# EAGLE design A10-A20-OLINUXINO-MICRO_Extension_Rev_A_STMP15x-SHIELD_GPIO1_EXTENSION (EAGLE 7.7.0)
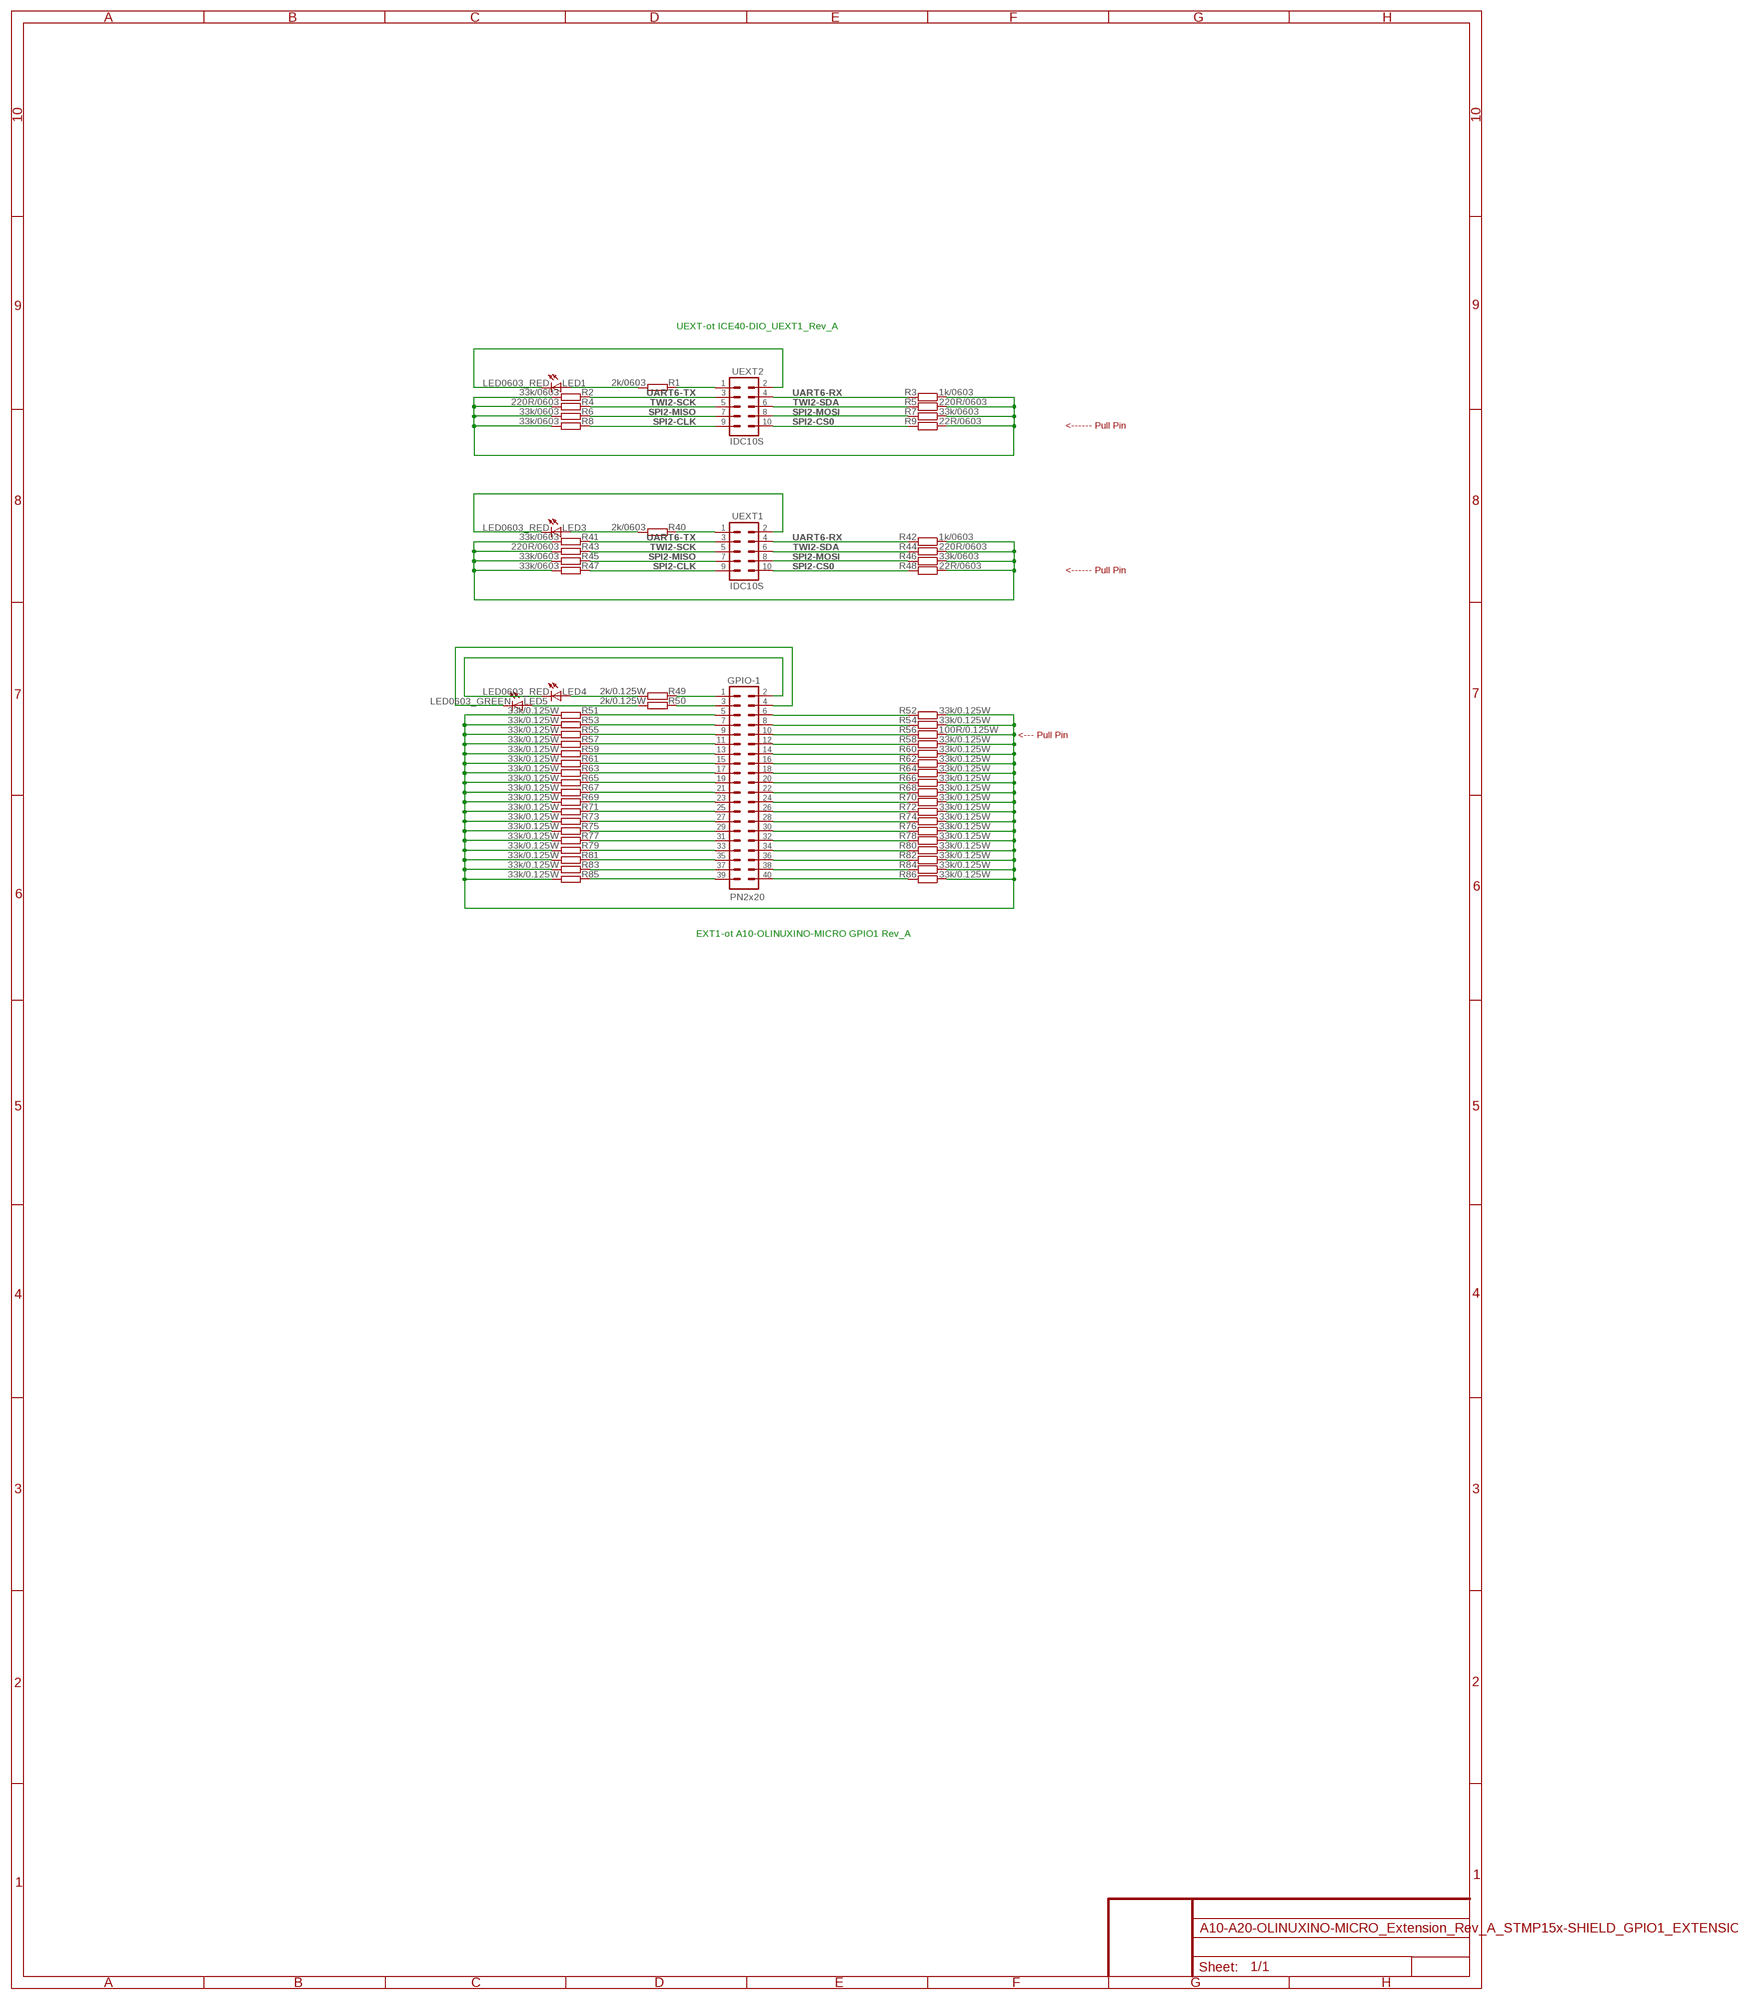
[diagram p0: schematic, sheet 1]

## Parts
GPIO-1  PN2x20  ML40PN2X20  [ML40-FEMALE(PN2X20)]
LED1  LED0603_RED  LED0603DWS  [LED-0603]
LED3  LED0603_RED  LED0603DWS  [LED-0603]
LED4  LED0603_RED  LED0603DWS  [LED-0603]
LED5  LED0603_GREEN  LED0603DWS  [LED-0603]
R1  2k/0603  R-EU_0204/5  [0204/5]
R2  33k/0603  R-EU_0204/5  [0204/5]
R3  1k/0603  R-EU_0204/5  [0204/5]
R4  220R/0603  R-EU_0204/5  [0204/5]
R5  220R/0603  R-EU_0204/5  [0204/5]
R6  33k/0603  R-EU_0204/5  [0204/5]
R7  33k/0603  R-EU_0204/5  [0204/5]
R8  33k/0603  R-EU_0204/5  [0204/5]
R9  22R/0603  R-EU_0204/5  [0204/5]
R40  2k/0603  R-EU_0204/5  [0204/5]
R41  33k/0603  R-EU_0204/5  [0204/5]
R42  1k/0603  R-EU_0204/5  [0204/5]
R43  220R/0603  R-EU_0204/5  [0204/5]
R44  220R/0603  R-EU_0204/5  [0204/5]
R45  33k/0603  R-EU_0204/5  [0204/5]
R46  33k/0603  R-EU_0204/5  [0204/5]
R47  33k/0603  R-EU_0204/5  [0204/5]
R48  22R/0603  R-EU_0204/5  [0204/5]
R49  2k/0.125W  R-EU_0204/5  [0204/5]
R50  2k/0.125W  R-EU_0204/5  [0204/5]
R51  33k/0.125W  R-EU_0204/5  [0204/5]
R52  33k/0.125W  R-EU_0204/5  [0204/5]
R53  33k/0.125W  R-EU_0204/5  [0204/5]
R54  33k/0.125W  R-EU_0204/5  [0204/5]
R55  33k/0.125W  R-EU_0204/5  [0204/5]
R56  100R/0.125W  R-EU_0204/5  [0204/5]
R57  33k/0.125W  R-EU_0204/5  [0204/5]
R58  33k/0.125W  R-EU_0204/5  [0204/5]
R59  33k/0.125W  R-EU_0204/5  [0204/5]
R60  33k/0.125W  R-EU_0204/5  [0204/5]
R61  33k/0.125W  R-EU_0204/5  [0204/5]
R62  33k/0.125W  R-EU_0204/5  [0204/5]
R63  33k/0.125W  R-EU_0204/5  [0204/5]
R64  33k/0.125W  R-EU_0204/5  [0204/5]
R65  33k/0.125W  R-EU_0204/5  [0204/5]
R66  33k/0.125W  R-EU_0204/5  [0204/5]
R67  33k/0.125W  R-EU_0204/5  [0204/5]
R68  33k/0.125W  R-EU_0204/5  [0204/5]
R69  33k/0.125W  R-EU_0204/5  [0204/5]
R70  33k/0.125W  R-EU_0204/5  [0204/5]
R71  33k/0.125W  R-EU_0204/5  [0204/5]
R72  33k/0.125W  R-EU_0204/5  [0204/5]
R73  33k/0.125W  R-EU_0204/5  [0204/5]
R74  33k/0.125W  R-EU_0204/5  [0204/5]
R75  33k/0.125W  R-EU_0204/5  [0204/5]
R76  33k/0.125W  R-EU_0204/5  [0204/5]
R77  33k/0.125W  R-EU_0204/5  [0204/5]
R78  33k/0.125W  R-EU_0204/5  [0204/5]
R79  33k/0.125W  R-EU_0204/5  [0204/5]
R80  33k/0.125W  R-EU_0204/5  [0204/5]
R81  33k/0.125W  R-EU_0204/5  [0204/5]
R82  33k/0.125W  R-EU_0204/5  [0204/5]
R83  33k/0.125W  R-EU_0204/5  [0204/5]
R84  33k/0.125W  R-EU_0204/5  [0204/5]
R85  33k/0.125W  R-EU_0204/5  [0204/5]
R86  33k/0.125W  R-EU_0204/5  [0204/5]
UEXT1  IDC10S  ML10ML10-FEMALE(IDC10S/PCB)  [ML10-FEMALE(IDC10S/PCB)]
UEXT2  IDC10S  ML10ML10-FEMALE(IDC10S/PCB)  [ML10-FEMALE(IDC10S/PCB)]

## Nets
GPIO1: GPIO-1.35 R81.2
GPIO2: GPIO-1.37 R83.2
GPIO3: GPIO-1.39 R85.2
N$1: LED1.A R1.1
N$2: R2.1 R3.1 R4.1 R5.1 R6.1 R7.1 R8.1 R9.1
N$3: R51.1 R52.1 R53.1 R54.1 R55.1 R56.1 R57.1 R58.1 R59.1 R60.1 R61.1 R62.1 R63.1 R64.1 R65.1 R66.1 R67.1 R68.1 R69.1 R70.1 R71.1 R72.1 R73.1 R74.1 R75.1 R76.1 R77.1 R78.1 R79.1 R80.1 R81.1 R82.1 R83.1 R84.1 R85.1 R86.1
N$4: R41.1 R42.1 R43.1 R44.1 R45.1 R46.1 R47.1 R48.1
N$5: LED3.A R40.1
N$6 [pwr]: R1.2 UEXT2.1
N$7 [pwr]: LED1.C UEXT2.2
N$8: LED5.A R50.1
N$9: LED4.A R49.1
N$15 [pwr]: LED3.C UEXT1.2
N$22 [pwr]: R40.2 UEXT1.1
N$24 [pwr]: GPIO-1.3 R50.2
N$25 [pwr]: GPIO-1.2 LED4.C
N$26 [pwr]: GPIO-1.4 LED5.C
N$27: GPIO-1.1 R49.2
NMI_N: GPIO-1.38 R84.2
PC3/NCE1: GPIO-1.21 R67.2
PC7/NRB1: GPIO-1.23 R69.2
PC16: GPIO-1.25 R71.2
PC17: GPIO-1.27 R73.2
PC18: GPIO-1.29 R75.2
PC23: GPIO-1.31 R77.2
PC24/NQS: GPIO-1.33 R79.2
PE0: GPIO-1.6 R52.2
PE1 [pwr]: GPIO-1.8 R54.2
PE2: GPIO-1.10 R56.2
PE3 [pwr]: GPIO-1.12 R58.2
PE4: GPIO-1.14 R60.2
PE5: GPIO-1.16 R62.2
PE6: GPIO-1.18 R64.2
PE7: GPIO-1.20 R66.2
PE8: GPIO-1.22 R68.2
PE9: GPIO-1.24 R70.2
PE10: GPIO-1.26 R72.2
PE11: GPIO-1.28 R74.2
PI0: GPIO-1.9 R55.2
PI1: GPIO-1.11 R57.2
PI2: GPIO-1.13 R59.2
PI3: GPIO-1.15 R61.2
PI10: GPIO-1.17 R63.2
PI11: GPIO-1.19 R65.2
PI14: GPIO-1.30 R76.2
PI15: GPIO-1.32 R78.2
RESET_N: GPIO-1.40 R86.2
SPI2-CLK: R8.2 R47.2 UEXT1.9 UEXT2.9
SPI2-CS0: R9.2 R48.2 UEXT1.10 UEXT2.10
SPI2-MISO: R6.2 R45.2 UEXT1.7 UEXT2.7
SPI2-MOSI: R7.2 R46.2 UEXT1.8 UEXT2.8
TWI0-SCK: GPIO-1.5 R51.2
TWI0-SDA: GPIO-1.7 R53.2
TWI2-SCK: R4.2 R43.2 UEXT1.5 UEXT2.5
TWI2-SDA: R5.2 R44.2 UEXT1.6 UEXT2.6
UART0-RX: GPIO-1.34 R80.2
UART0-TX: GPIO-1.36 R82.2
UART6-RX: R3.2 R42.2 UEXT1.4 UEXT2.4
UART6-TX: R2.2 R41.2 UEXT1.3 UEXT2.3

## Notes on the sheet
- UEXT-ot ICE40-DIO_UEXT1_Rev_A
- <------ Pull Pin
- <------ Pull Pin
- <--- Pull Pin
- EXT1-ot A10-OLINUXINO-MICRO GPIO1 Rev_A

## Library data of the parts
GPIO-1 = con-harting-ml:ML40: HARTING
LED1 LED3-LED5 = DOUBLE-SIDE:LED
R1-R9 R40-R86 = rcl:R-EU_: RESISTOR, European symbol
UEXT1 UEXT2 = con-harting-ml:ML10: HARTING

## Board
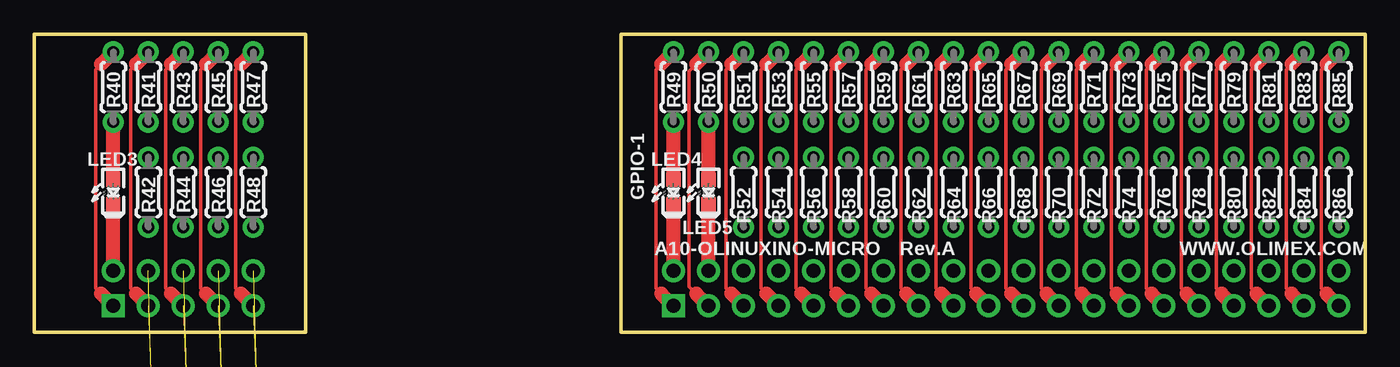
[diagram p1: board, top side]
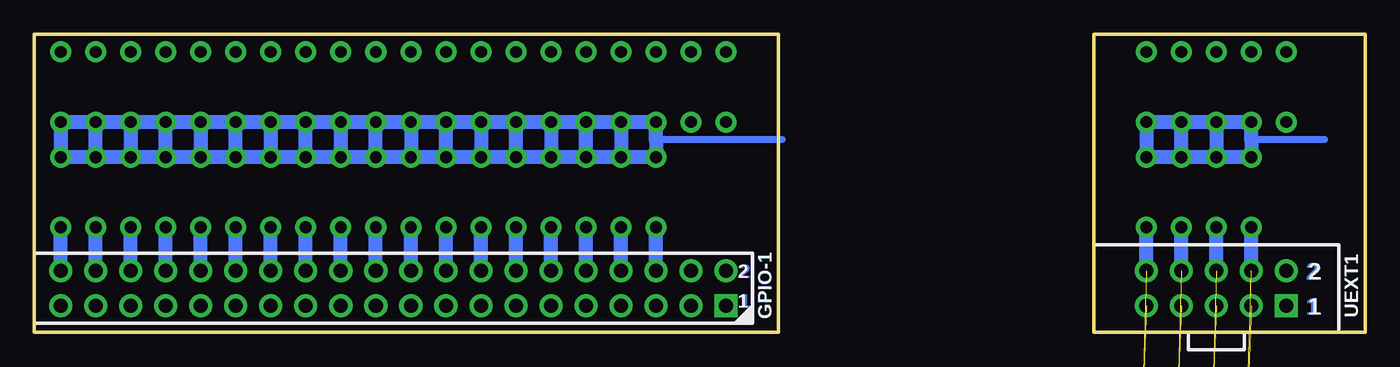
[diagram p2: board, bottom side, seen from below]

Size 96.52 x 21.59 mm. Coordinates in mm from the lower left corner, seen from the top.
Outline: 42.55,0 96.52,0 96.52,21.59 42.55,21.59 42.55,0
Outline: 19.68,0 0,0 0,21.59 19.68,21.59 19.68,0
Copper layers (1*2*15*16): Top 0.018mm / dielectric 0.12mm / Route2 0.035mm / dielectric 1.2mm / Route15 0.035mm / dielectric 0.12mm / Bottom 0.018mm
Design rules "default": minimum track width 4.5mil, minimum drill 10mil, track to track 5mil, track to pad 5mil, pad to pad 5mil, via to via 5mil, smd to smd 1mil, copper to edge 10mil, drill to drill 8mil, minimum pad ring 6mil, minimum via ring 4mil, stop-mask expansion 4mil, vias tented up to drill 25mil, thermal gap 12mil

### Footprints (pad centres in the part's own frame; a part is rotated, then mirrored left to right if it is on the bottom)
ML40-FEMALE(PN2X20) = drill 1.016 pad 1.676 square: 1 -24.13,1.27 | drill 1.016 pad 1.676: 2 -24.13,-1.27; 3 -21.59,1.27; 4 -21.59,-1.27; 5 -19.05,1.27; 6 -19.05,-1.27; 7 -16.51,1.27; 8 -16.51,-1.27; 9 -13.97,1.27; 10 -13.97,-1.27; 11 -11.43,1.27; 12 -11.43,-1.27; 13 -8.89,1.27; 14 -8.89,-1.27; 15 -6.35,1.27; 16 -6.35,-1.27; 17 -3.81,1.27; 18 -3.81,-1.27; 19 -1.27,1.27; 20 -1.27,-1.27; 21 1.27,1.27; 22 1.27,-1.27; 23 3.81,1.27; 24 3.81,-1.27; 25 6.35,1.27; 26 6.35,-1.27; 27 8.89,1.27; 28 8.89,-1.27; 29 11.43,1.27; 30 11.43,-1.27; 31 13.97,1.27; 32 13.97,-1.27; 33 16.51,1.27; 34 16.51,-1.27; 35 19.05,1.27; 36 19.05,-1.27; 37 21.59,1.27; 38 21.59,-1.27; 39 24.13,1.27; 40 24.13,-1.27
LED-0603 = smd 1.016 x 1.016: A 0.889,0; C -0.889,0
0204/5 = drill 0.864 pad 1.524: 1 -2.54,0; 2 2.54,0
ML10-FEMALE(IDC10S/PCB) = drill 1.016 pad 1.676 square: 1 -5.08,1.27 | drill 1.016 pad 1.676: 2 -5.08,-1.27; 3 -2.54,1.27; 4 -2.54,-1.27; 5 0,1.27; 6 0,-1.27; 7 2.54,1.27; 8 2.54,-1.27; 9 5.08,1.27; 10 5.08,-1.27

### Placement (x,y rotation side)
GPIO-1  70.48,3.17 180 bottom
LED1  41.91,-76.2 0 top  (outside the outline)
LED3  5.71,10.16 90 top
LED4  46.35,10.16 90 top
LED5  48.9,10.16 90 top
R1  35.56,-15.24 0 top  (outside the outline)
R2  7.62,-34.29 0 top  (outside the outline)
R3  27.94,-34.29 0 top  (outside the outline)
R4  7.62,-49.53 0 top  (outside the outline)
R5  27.94,-49.53 0 top  (outside the outline)
R6  7.62,-64.77 0 top  (outside the outline)
R7  27.94,-64.77 0 top  (outside the outline)
R8  7.62,-80.01 0 top  (outside the outline)
R9  27.94,-80.01 0 top  (outside the outline)
R40  5.71,17.78 90 top
R41  8.26,17.78 90 top
R42  8.26,10.16 270 top
R43  10.79,17.78 90 top
R44  10.79,10.16 270 top
R45  13.34,17.78 90 top
R46  13.34,10.16 270 top
R47  15.88,17.78 90 top
R48  15.88,10.16 270 top
R49  46.35,17.78 90 top
R50  48.9,17.78 90 top
R51  51.44,17.78 90 top
R52  51.44,10.16 270 top
R53  53.98,17.78 90 top
R54  53.98,10.16 270 top
R55  56.52,17.78 90 top
R56  56.52,10.16 270 top
R57  59.05,17.78 90 top
R58  59.05,10.16 270 top
R59  61.59,17.78 90 top
R60  61.59,10.16 270 top
R61  64.14,17.78 90 top
R62  64.14,10.16 270 top
R63  66.67,17.78 90 top
R64  66.67,10.16 270 top
R65  69.22,17.78 90 top
R66  69.22,10.16 270 top
R67  71.75,17.78 90 top
R68  71.75,10.16 270 top
R69  74.3,17.78 90 top
R70  74.3,10.16 270 top
R71  76.83,17.78 90 top
R72  76.83,10.16 270 top
R73  79.38,17.78 90 top
R74  79.38,10.16 270 top
R75  81.92,17.78 90 top
R76  81.92,10.16 270 top
R77  84.45,17.78 90 top
R78  84.45,10.16 270 top
R79  87,17.78 90 top
R80  87,10.16 270 top
R81  89.53,17.78 90 top
R82  89.53,10.16 270 top
R83  92.08,17.78 90 top
R84  92.08,10.16 270 top
R85  94.61,17.78 90 top
R86  94.61,10.16 270 top
UEXT1  10.79,3.17 180 bottom
UEXT2  11.43,-16.51 0 top  (outside the outline)

### Tracks (layer width: path | path; a pad name or v marks a point on that pad's centre or on a via)
GPIO1
  Top 0.254: 88.65,19.43 88.27,19.05 88.27,3.17 88.65,2.79
  Top 1.016: GPIO-1.35 88.65,2.79 | 88.65,19.43 R81.2
GPIO2
  Top 0.254: 91.19,19.43 90.81,19.05 90.81,3.17 91.19,2.79
  Top 1.016: GPIO-1.37 91.19,2.79 | 91.19,19.43 R83.2
GPIO3
  Top 0.254: 93.73,19.43 93.34,19.05 93.34,3.17 93.73,2.79
  Top 1.016: GPIO-1.39 93.73,2.79 | 93.73,19.43 R85.2
N$1  (1 unrouted)
N$2  (7 unrouted)
N$3
  Bottom 0.508: 42.29,13.97 51.44,13.97
  Bottom 1.016: R53.1 R51.1 51.44,13.97 R52.1 R54.1 | R53.1 R54.1 | R54.1 R56.1 | R53.1 R55.1 | R56.1 R55.1 | R56.1 R58.1 | R55.1 R57.1 | R57.1 R58.1 | R58.1 R60.1 | R57.1 R59.1 | R60.1 R59.1 | R60.1 R62.1 | R59.1 R61.1 | R61.1 R62.1 | R62.1 R64.1 | R61.1 R63.1 | R64.1 R63.1 | R64.1 R66.1 | R63.1 R65.1 | R65.1 R66.1 | R66.1 R68.1 | R65.1 R67.1 | R68.1 R67.1 | R68.1 R70.1 | R67.1 R69.1 | R69.1 R70.1 | R70.1 R72.1 | R69.1 R71.1 | R72.1 R71.1 | R72.1 R74.1 | R71.1 R73.1 | R73.1 R74.1 | R74.1 R76.1 | R73.1 R75.1 | R76.1 R75.1 | R76.1 R78.1 | R75.1 R77.1 | R77.1 R78.1 | R78.1 R80.1 | R77.1 R79.1 | R80.1 R79.1 | R80.1 R82.1 | R79.1 R81.1 | R81.1 R82.1 | R82.1 R84.1 | R81.1 R83.1 | R84.1 R83.1 | R84.1 R86.1 R85.1 R83.1
N$4
  Bottom 0.508: 2.92,13.97 8.26,13.97
  Bottom 1.016: R43.1 R41.1 8.26,13.97 R42.1 R44.1 | R43.1 R44.1 | R44.1 R46.1 | R46.1 R45.1 | R46.1 R48.1 R47.1 R45.1 | R43.1 R45.1
N$5
  Top 1.016: LED3.A R40.1
N$6  (1 unrouted)
N$7  (1 unrouted)
N$8
  Top 1.016: LED5.A R50.1
N$9
  Top 1.016: LED4.A R49.1
N$15
  Top 1.016: UEXT1.2 LED3.C
N$22
  Top 0.254: 4.83,19.43 4.45,19.05 4.45,3.17 4.83,2.79
  Top 1.016: UEXT1.1 4.83,2.79 | 4.83,19.43 R40.2
N$24
  Top 0.254: 48.01,19.43 47.5,18.92 47.5,3.3 48.01,2.79
  Top 1.016: GPIO-1.3 48.01,2.79 | 48.01,19.43 R50.2
N$25
  Top 1.016: GPIO-1.2 LED4.C
N$26
  Top 1.016: GPIO-1.4 LED5.C
N$27
  Top 0.254: 45.47,2.79 45.09,3.17 45.09,19.05 45.47,19.43
  Top 1.016: GPIO-1.1 45.47,2.79 | 45.47,19.43 R49.2
NMI_N
  Bottom 1.016: GPIO-1.38 R84.2
PC3/NCE1
  Top 0.254: 70.87,19.43 70.48,19.05 70.48,3.17 70.87,2.79
  Top 1.016: GPIO-1.21 70.87,2.79 | 70.87,19.43 R67.2
PC7/NRB1
  Top 0.254: 73.41,19.43 73.03,19.05 73.03,3.17 73.41,2.79
  Top 1.016: GPIO-1.23 73.41,2.79 | 73.41,19.43 R69.2
PC16
  Top 0.254: 75.95,19.43 75.56,19.05 75.56,3.17 75.95,2.79
  Top 1.016: GPIO-1.25 75.95,2.79 | 75.95,19.43 R71.2
PC17
  Top 0.254: 78.49,19.43 78.11,19.05 78.11,3.17 78.49,2.79
  Top 1.016: GPIO-1.27 78.49,2.79 | 78.49,19.43 R73.2
PC18
  Top 0.254: 81.03,19.43 80.64,19.05 80.64,3.17 81.03,2.79
  Top 1.016: GPIO-1.29 81.03,2.79 | 81.03,19.43 R75.2
PC23
  Top 0.254: 83.57,19.43 83.19,19.05 83.19,3.17 83.57,2.79
  Top 1.016: GPIO-1.31 83.57,2.79 | 83.57,19.43 R77.2
PC24/NQS
  Top 0.254: 86.11,19.43 85.72,19.05 85.72,3.17 86.11,2.79
  Top 1.016: GPIO-1.33 86.11,2.79 | 86.11,19.43 R79.2
PE0
  Bottom 1.016: GPIO-1.6 R52.2
PE1
  Bottom 1.016: GPIO-1.8 R54.2
PE2
  Bottom 1.016: GPIO-1.10 R56.2
PE3
  Bottom 1.016: GPIO-1.12 R58.2
PE4
  Bottom 1.016: GPIO-1.14 R60.2
PE5
  Bottom 1.016: GPIO-1.16 R62.2
PE6
  Bottom 1.016: GPIO-1.18 R64.2
PE7
  Bottom 1.016: GPIO-1.20 R66.2
PE8
  Bottom 1.016: GPIO-1.22 R68.2
PE9
  Bottom 1.016: GPIO-1.24 R70.2
PE10
  Bottom 1.016: GPIO-1.26 R72.2
PE11
  Bottom 1.016: GPIO-1.28 R74.2
PI0
  Top 0.254: 55.63,19.43 55.24,19.05 55.24,3.17 55.63,2.79
  Top 1.016: GPIO-1.9 55.63,2.79 | 55.63,19.43 R55.2
PI1
  Top 0.254: 58.17,19.43 57.78,19.05 57.78,3.17 58.17,2.79
  Top 1.016: GPIO-1.11 58.17,2.79 | 58.17,19.43 R57.2
PI2
  Top 0.254: 60.71,19.43 60.33,19.05 60.33,3.17 60.71,2.79
  Top 1.016: GPIO-1.13 60.71,2.79 | 60.71,19.43 R59.2
PI3
  Top 0.254: 63.25,19.43 62.87,19.05 62.87,3.17 63.25,2.79
  Top 1.016: GPIO-1.15 63.25,2.79 | 63.25,19.43 R61.2
PI10
  Top 0.254: 65.79,19.43 65.41,19.05 65.41,3.17 65.79,2.79
  Top 1.016: GPIO-1.17 65.79,2.79 | 65.79,19.43 R63.2
PI11
  Top 0.254: 68.33,19.43 67.94,19.05 67.94,3.17 68.33,2.79
  Top 1.016: GPIO-1.19 68.33,2.79 | 68.33,19.43 R65.2
PI14
  Bottom 1.016: GPIO-1.30 R76.2
PI15
  Bottom 1.016: GPIO-1.32 R78.2
RESET_N
  Bottom 1.016: GPIO-1.40 R86.2
SPI2-CLK  (2 unrouted)
  Top 0.254: 14.99,2.79 14.61,3.17 14.61,19.05 14.99,19.43
  Top 1.016: 14.99,19.43 R47.2 | UEXT1.9 14.99,2.79
SPI2-CS0  (2 unrouted)
  Bottom 1.016: UEXT1.10 R48.2
SPI2-MISO  (2 unrouted)
  Top 0.254: 12.45,19.43 12.06,19.05 12.06,3.17 12.45,2.79
  Top 1.016: 12.45,19.43 R45.2 | UEXT1.7 12.45,2.79
SPI2-MOSI  (2 unrouted)
  Bottom 1.016: UEXT1.8 R46.2
TWI0-SCK
  Top 0.254: 50.55,19.43 50.16,19.05 50.16,3.17 50.55,2.79
  Top 1.016: GPIO-1.5 50.55,2.79 | 50.55,19.43 R51.2
TWI0-SDA
  Top 0.254: 53.09,19.43 52.7,19.05 52.7,3.17 53.09,2.79
  Top 1.016: GPIO-1.7 53.09,2.79 | 53.09,19.43 R53.2
TWI2-SCK  (2 unrouted)
  Top 0.254: 9.91,19.43 9.53,19.05 9.53,3.17 9.91,2.79
  Top 1.016: 9.91,19.43 R43.2 | UEXT1.5 9.91,2.79
TWI2-SDA  (2 unrouted)
  Bottom 1.016: UEXT1.6 R44.2
UART0-RX
  Bottom 1.016: GPIO-1.34 R80.2
UART0-TX
  Bottom 1.016: GPIO-1.36 R82.2
UART6-RX  (2 unrouted)
  Bottom 1.016: UEXT1.4 R42.2
UART6-TX  (2 unrouted)
  Top 0.254: 7.37,2.79 6.99,3.17 6.99,19.05 7.37,19.43
  Top 1.016: 7.37,19.43 R41.2 | UEXT1.3 7.37,2.79

### Text on the board
Bottom: 2 | 2 | 1 | 1
tNames: A10-OLINUXINO-MICRO | Rev.A | WWW.OLIMEX.COM